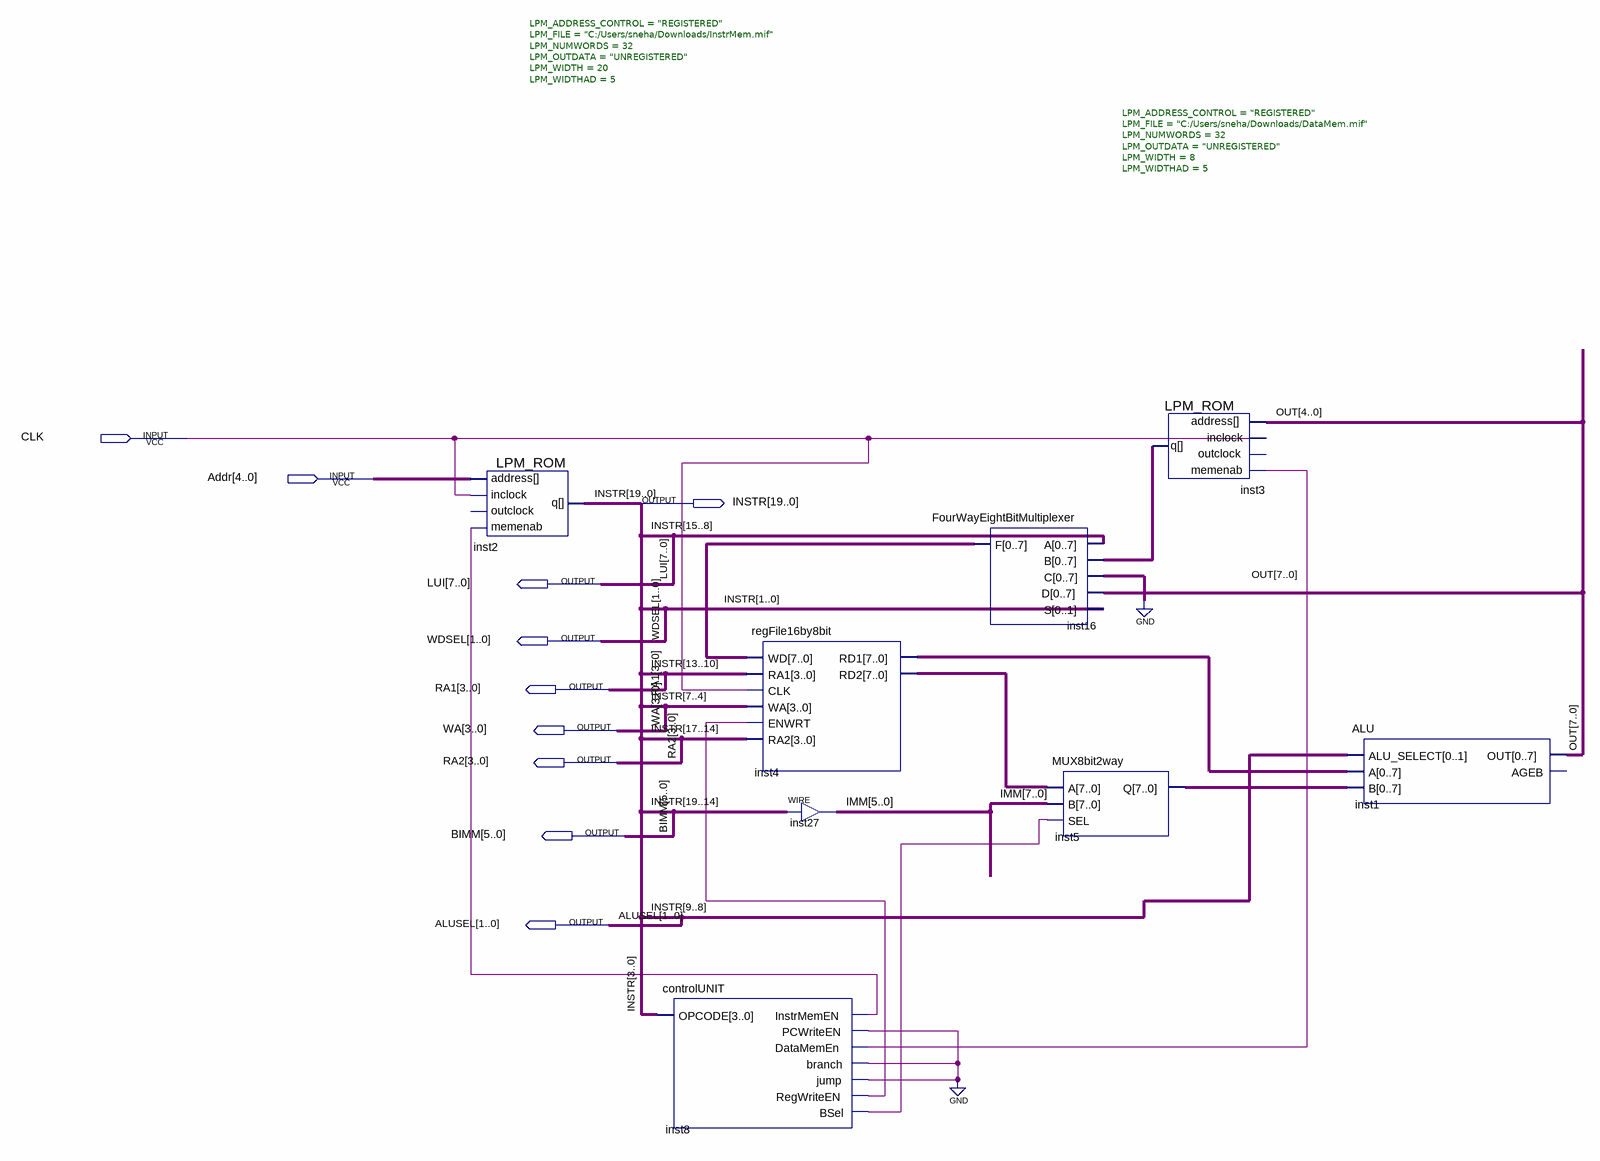
[diagram p0: schematic sheet]
// Quartus schematic DATAPATH02.bdf as structural Verilog: 8 symbols, 10 pins
module DATAPATH02 (
  input  CLK,
  input  [4:0] Addr,
  output [19:0] INSTR,
  output [7:0] LUI,
  output [1:0] WDSEL,
  output [3:0] RA1,
  output [3:0] WA,
  output [3:0] RA2,
  output [5:0] BIMM,
  output [1:0] ALUSEL
);

  wire inst8_bsel, inst8_datamemen, inst8_instrmemen, inst8_pcwriteen, inst8_regwriteen;
  wire [7:0] IMM, inst3_q, inst4_rd1, inst4_rd2, inst5_q, inst16_f, OUT;

  LPM_ROM #(.LPM_ADDRESS_CONTROL("REGISTERED"), .LPM_FILE("C:/Users/sneha/Downloads/InstrMem.mif"), .LPM_NUMWORDS(32), .LPM_OUTDATA("UNREGISTERED"), .LPM_WIDTH(20), .LPM_WIDTHAD(5)) inst2 (
    .address(Addr), .inclock(CLK), .memenab(inst8_instrmemen), .q(INSTR));  // open: outclock
  controlUNIT inst8 (
    .OPCODE(INSTR[3:0]), .InstrMemEN(inst8_instrmemen), .PCWriteEN(inst8_pcwriteen),
    .DataMemEn(inst8_datamemen), .branch(inst8_pcwriteen), .jump(inst8_pcwriteen),
    .RegWriteEN(inst8_regwriteen), .BSel(inst8_bsel));
  regFile16by8bit inst4 (
    .WD(inst16_f), .RA1(INSTR[13:10]), .CLK(CLK), .WA(INSTR[7:4]), .ENWRT(inst8_regwriteen),
    .RA2(INSTR[17:14]), .RD1(inst4_rd1), .RD2(inst4_rd2));
  assign IMM[5:0] = INSTR[19:14];  // WIRE inst27
  FourWayEightBitMultiplexer inst16 (
    .A(INSTR[15:8]), .B(inst3_q), .C({8{1'b0}}), .D(OUT), .S(INSTR[1:0]), .F(inst16_f));
  MUX8bit2way inst5 (.A(inst4_rd2), .B(IMM), .SEL(inst8_bsel), .Q(inst5_q));
  LPM_ROM #(.LPM_ADDRESS_CONTROL("REGISTERED"), .LPM_FILE("C:/Users/sneha/Downloads/DataMem.mif"), .LPM_NUMWORDS(32), .LPM_OUTDATA("UNREGISTERED"), .LPM_WIDTH(8), .LPM_WIDTHAD(5)) inst3 (
    .address(OUT[4:0]), .inclock(CLK), .memenab(inst8_datamemen), .q(inst3_q));  // open: outclock
  ALU inst1 (.ALU_SELECT(ALUSEL), .A(inst4_rd1), .B(inst5_q), .OUT(OUT));  // open: AGEB
  // also tied to GND on the sheet: inst8_pcwriteen
endmodule
